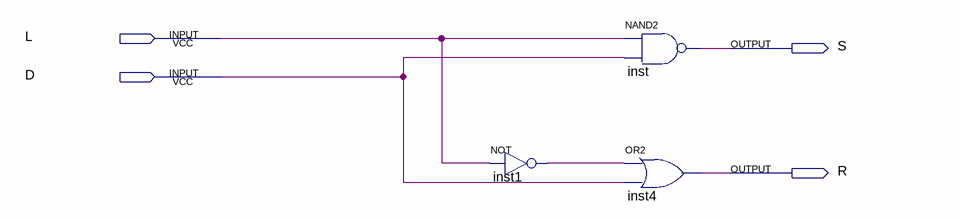
[diagram p0: schematic sheet]
// Quartus schematic LOAD.bdf as structural Verilog: 3 symbols, 4 pins
module LOAD (
  input  L,
  input  D,
  output S,
  output R
);

  wire inst1_out;

  not inst1 (inst1_out, L);
  nand inst (S, L, D);
  or inst4 (R, inst1_out, D);
endmodule
